# EAGLE schematic 1-553C original (EAGLE 8.0.0)
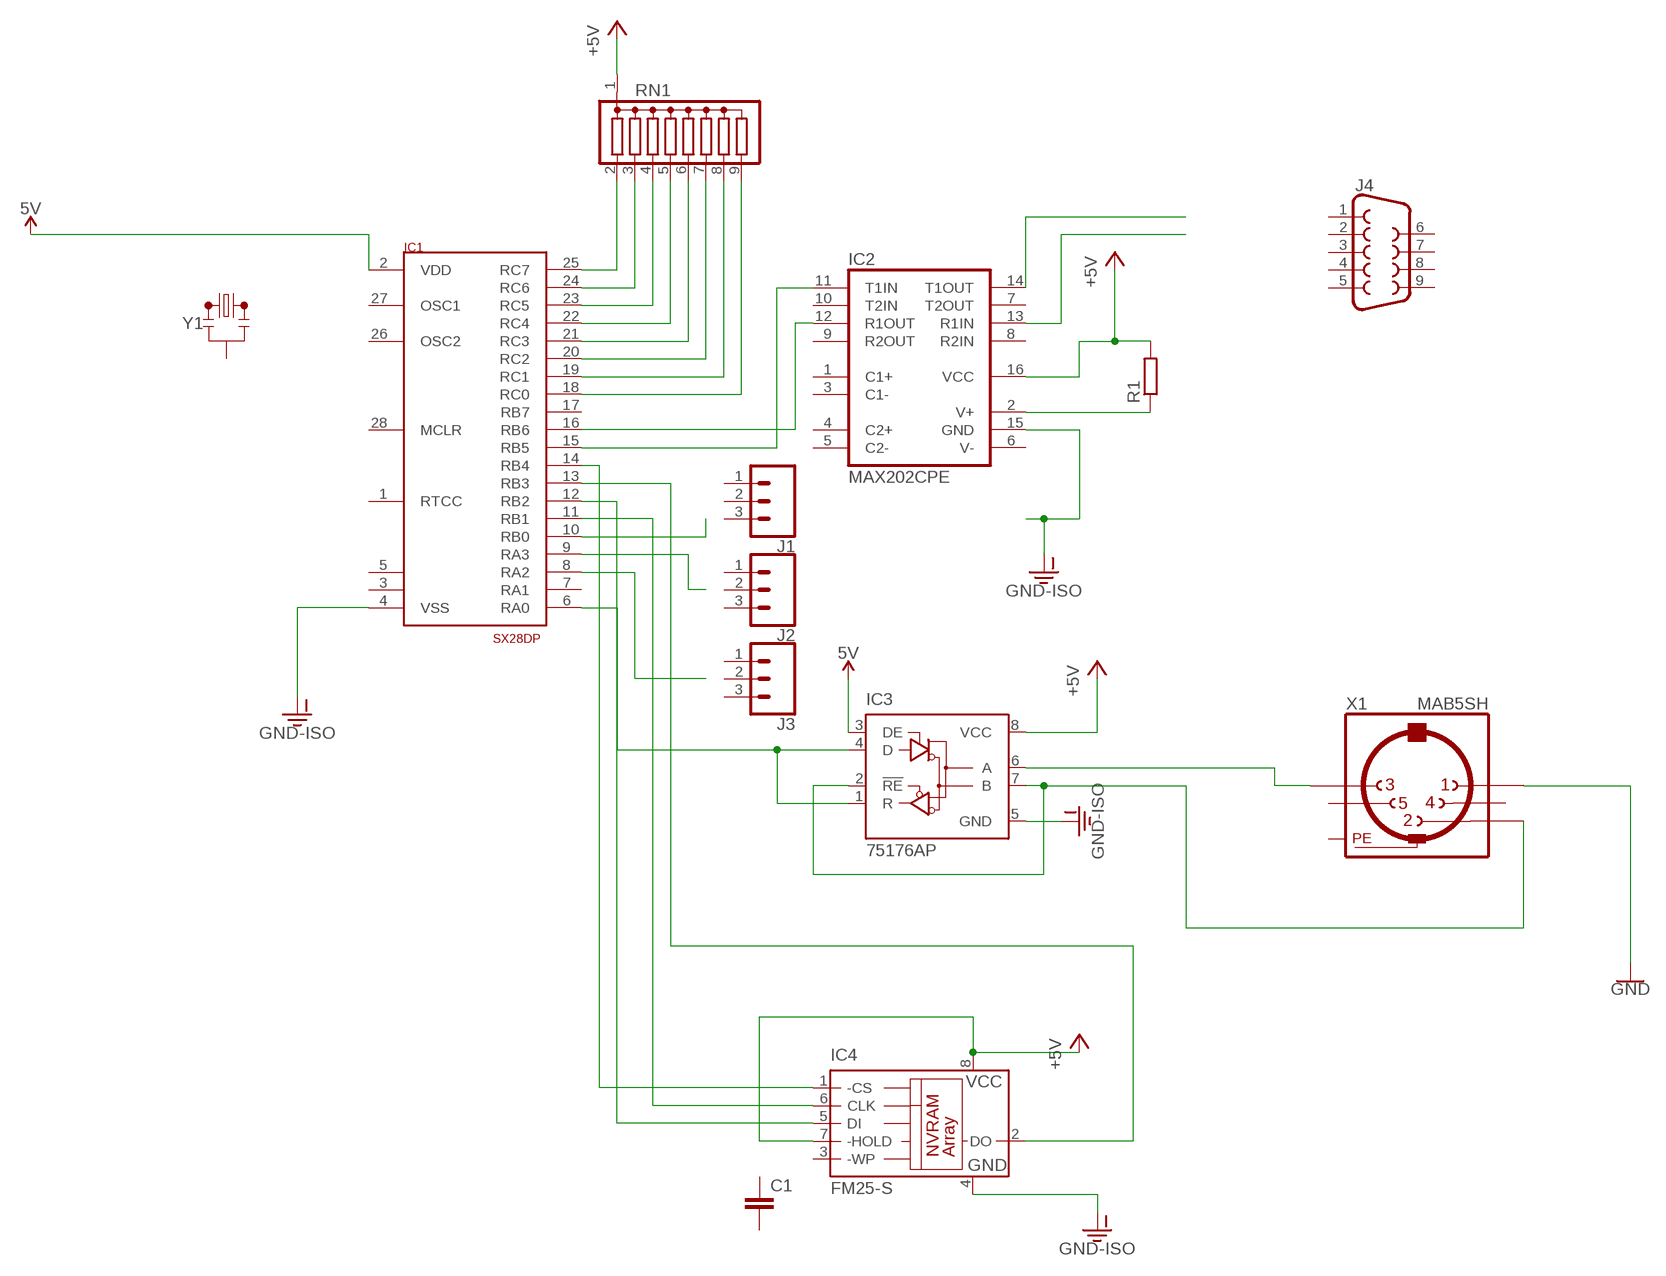
[diagram p0: schematic, sheet 1]

## Parts
C1  C-EU025-024X044  [C025-024X044]
IC1  SX28AC/DP  [28DIP]
IC2  MAX202CPE  [DIL16]
IC3  75176AP  [DIL08]
IC4  FM25-S  [SO8]
J1  CONN_03  [1X03]
J2  CONN_03  [1X03]
J3  CONN_03  [1X03]
J4  DB9FEMALE  [DB9]
R1  R-EU_0204/5  [0204/5]
RN1  G08R  [SIL9]
X1  MAB5SH  [MAB5SH]
Y1  RESONATORPTH-7.6X3.8  [RESONATOR-PTH-7.6X3.8]

## Nets
5V: IC1.2(VDD) IC3.3(DE)
+5V: IC2.16(VCC) IC3.8(VCC) IC4.7(-HOLD) IC4.8(VCC) R1.2 RN1.1
GND: X1.1
GND-ISO: IC1.4(VSS) IC2.15(GND) IC3.5(GND) IC4.4(GND)
N$1: IC1.6(RA0) IC3.1(R) IC3.4(D)
N$2: IC1.15(RB5) IC2.11(T1IN)
N$3: IC1.18(RC0) RN1.9
N$4: IC1.19(RC1) RN1.8
N$5: IC1.20(RC2) RN1.7
N$6: IC1.21(RC3) RN1.6
N$7: IC1.22(RC4) RN1.5
N$8: IC1.23(RC5) RN1.4
N$9: IC1.24(RC6) RN1.3
N$10: IC1.25(RC7) RN1.2
N$11: IC1.9(RA3)
N$12: IC1.8(RA2)
N$13: IC1.10(RB0)
N$14: IC3.2(!RE) IC3.7(B) X1.2
N$15: IC3.6(A) X1.3
N$16: IC2.13(R1IN)
N$17: IC2.14(T1OUT)
N$18: IC1.13(RB3) IC4.2(DO)
N$19: IC1.16(RB6) IC2.12(R1OUT)
N$20: IC1.11(RB1) IC4.6(CLK)
N$21: IC1.12(RB2) IC4.5(DI)
N$22: IC1.14(RB4) IC4.1(-CS)
V+: IC2.2(V+) R1.1
Unconnected: C1.1 C1.2 IC1.1(RTCC) IC1.3 IC1.5 IC1.7(RA1) IC1.17(RB7) IC1.26(OSC2) IC1.27(OSC1) IC1.28(MCLR) IC2.1(C1+) IC2.3(C1-) IC2.4(C2+) IC2.5(C2-) IC2.6(V-) IC2.7(T2OUT) IC2.8(R2IN) IC2.9(R2OUT) IC2.10(T2IN) IC4.3(-WP) J1.1 J1.2 J1.3 J2.1 J2.2 J2.3 J3.1 J3.2 J3.3 J4.1 J4.2 J4.3 J4.4 J4.5 J4.6 J4.7 J4.8 J4.9 X1.4 X1.5 Y1.1 Y1.2 Y1.3

## Power pins joined to a net without a drawn wire
PE: X1.PE X1.PE@(PE)

## Library data of the parts
C1 = rcl:C-EU: CAPACITOR, European symbol
IC1 = ubicom_v2:SX28AC/DP
IC2 = maxim:MAX202CPE: RS232 TRANSCEIVER; MF: MAXIM; MPN: MAX202CPE+; OC_FARNELL: 9723803; OC_NEWARK: 68K4531
IC3 = 751xx:75176A: DIFFERENTIAL BUS TRANSCEIVER Source: http://focus.ti.com/lit/ds/symlink/sn75176a.pdf
IC4 = ramtron:FM25*: SPI Serial NVRAM
J1-J3 = SparkFun-Connectors:CONN_03: Multi connection point. Often used as Generic Header-pin footprint for 0.1 inch spaced/style header connections On any of the 0.1 inch spaced packages, you can populate with these: Break Away Headers - Straight <https://www.sparkfun.com/products/116> (PRT-00116) Break Away Male Headers - Right Angle <https://www.sparkfun.com/products/553> (PRT-00553) Female Headers <https://www.sparkfun.com/products/115> (PRT-00115) Break Away Headers - Machine Pin <https://www.sparkfun.com/products/117> (PRT-00117) Break Away Female Headers - Swiss Machine Pin <https://www.sparkfun.com/products/743> (PRT-00743) Stackable Header - 3 Pin (Female, 0.1") <https://www.sparkfun.com/products/13875> (PRT-13875) For SCREWTERMINALS and SPRING TERMINALS visit here: Screw Terimnals on SparkFun.com <https://www.sparkfun.com/search/results?term=Screw+Terminals> (5mm/3.5mm/2.54mm spacing) This device is also useful as a general connection point to wire up your design to another part of your project. Our various solder wires solder well into these plated through hole pads. Hook-Up Wire - Assortment (Stranded, 22 AWG) <https://www.sparkfun.com/products/11375> (PRT-11375) Hook-Up Wire - Assortment (Solid Core, 22 AWG) <https://www.sparkfun.com/products/11367> (PRT-11367) View the entire wire category on our website here <https://www.sparkfun.com/categories/141> Special notes: Molex polarized connector foot print use with SKU : PRT-08232 with associated crimp pins and housings.
J4 = SparkFun-Connectors:DB9: DB9 Connector Standard DB9 (D-Sub 9) serial connector. Can be used for CAN bus as well as RS485 and RS232. Footprint production proven. Here is the female version connector we sell at SparkFun: 9 Pin Female Serial Connector - PCB Mount <https://www.sparkfun.com/products/429> (PRT-00429) This connector has been used on the following SparkFun products: SparkFun RS232 Shifter - SMD <https://www.sparkfun.com/products/449> (PRT-00449) SparkFun RS232 Shifter SMD (No DB9) <https://www.sparkfun.com/products/8780> (PRT-08780); PROD_ID: CONN-08194
R1 = resistor:R-EU_: RESISTOR, European symbol
RN1 = resistor-sil:G08R: SIL RESISTOR; OC_FARNELL: unknown; OC_NEWARK: unknown
X1 = con-hirschmann:MAB5SH: Female CONNECTOR 5 pins 90 deg. with shield, horizontal (DIN 41524); OC_FARNELL: 809883; OC_NEWARK: unknown
Y1 = SparkFun-Clocks:RESONATOR: Resonators (Generic) Ceramic resonators are clock-generating components, often used to control timing in microcontrollers. They usually have 3 pins: two pins for oscillation, and one pin for ground. Compared to crystals, resonators have worse tolerance, but are usually much cheaper. Plus, they have built-in load capacitors! These devices are used on boards like the Arduino Pro 8MHz <https://www.sparkfun.com/products/11114> and Arduino Pro 16MHz <https://www.sparkfun.com/products/11113>.